# Altium schematic sheet CENTRALLEDS.SchDoc: Central LEDs
size B; Author: Sébastien Gélinas; Organization: SmartHalo; Address1: 5445 de Gaspé; Address2: Montréal, QC; Address3: Canada; Address4: H2T 3B2; Revision: 1; SheetNumber: 2; SheetTotal: 4
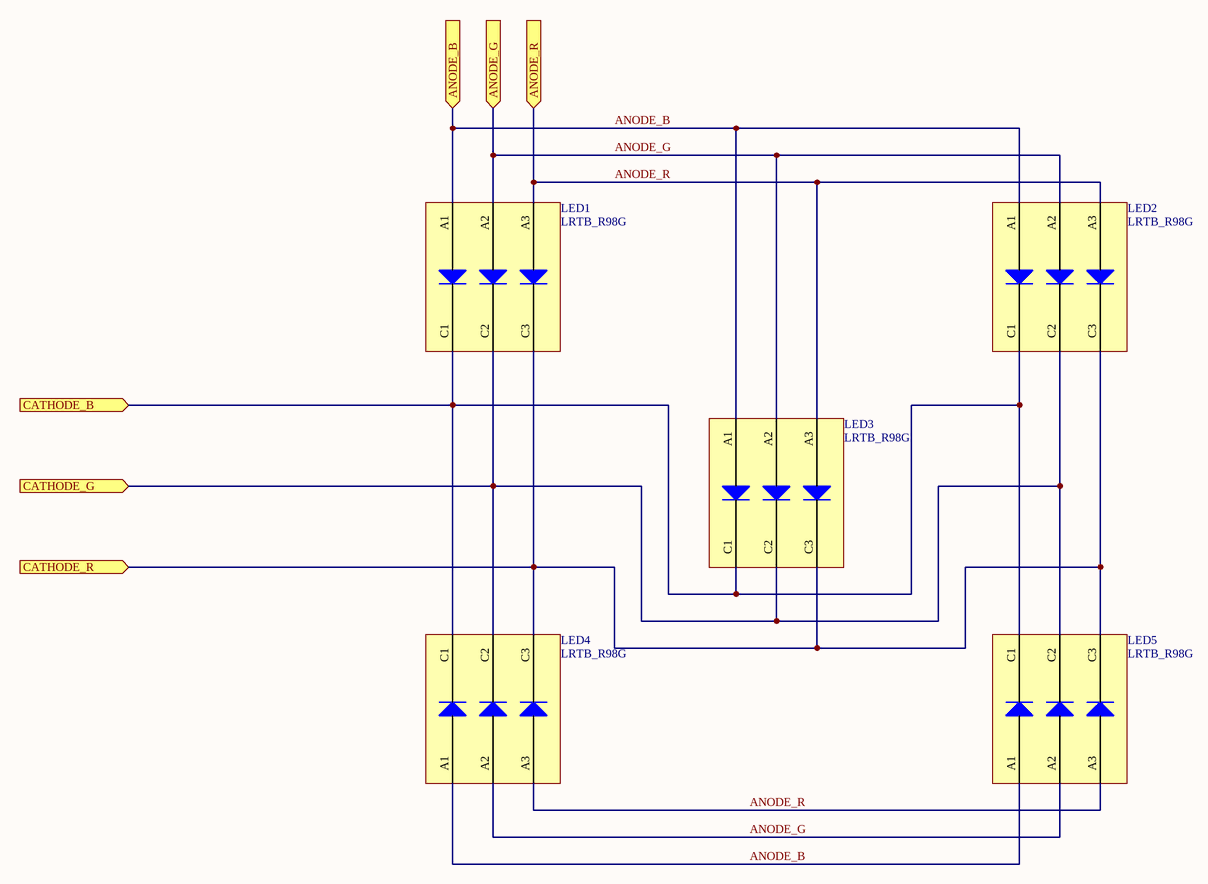
[diagram p0: CENTRALLEDS.SchDoc]

## Parts
LED1  LRTB_R98G  [LRTB_R98G]
LED2  LRTB_R98G  [LRTB_R98G]
LED3  LRTB_R98G  [LRTB_R98G]
LED4  LRTB_R98G  [LRTB_R98G]
LED5  LRTB_R98G  [LRTB_R98G]

## Ports
ANODE_B (in), ANODE_G (in), ANODE_R (in), CATHODE_B (in), CATHODE_G (in), CATHODE_R (in)

## Nets
ANODE_B: LED1.A1(Anode_Blue) LED2.A1(Anode_Blue) LED3.A1(Anode_Blue) LED4.A1(Anode_Blue) LED5.A1(Anode_Blue) ; port ANODE_B
ANODE_G: LED1.A2(Anode_Green) LED2.A2(Anode_Green) LED3.A2(Anode_Green) LED4.A2(Anode_Green) LED5.A2(Anode_Green) ; port ANODE_G
ANODE_R: LED1.A3(Anode_Red) LED2.A3(Anode_Red) LED3.A3(Anode_Red) LED4.A3(Anode_Red) LED5.A3(Anode_Red) ; port ANODE_R
CATHODE_B: LED1.C1(Cathode_Blue) LED2.C1(Cathode_Blue) LED3.C1(Cathode_Blue) LED4.C1(Cathode_Blue) LED5.C1(Cathode_Blue) ; port CATHODE_B
CATHODE_G: LED1.C2(Cathode_Green) LED2.C2(Cathode_Green) LED3.C2(Cathode_Green) LED4.C2(Cathode_Green) LED5.C2(Cathode_Green) ; port CATHODE_G
CATHODE_R: LED1.C3(Cathode_Red) LED2.C3(Cathode_Red) LED3.C3(Cathode_Red) LED4.C3(Cathode_Red) LED5.C3(Cathode_Red) ; port CATHODE_R

## Notes on the sheet
- Title
- Size:
- Date:
- B
- Author:
- Time:
- Sheet
- Revision:
- of
- File:

## Library data of the parts
LED1-LED5 = LRTB_R98G: IC RGB LED OSRAM; Manufacturer: OSRAM